# EAGLE design gps-carrier (EAGLE 6.6.0)
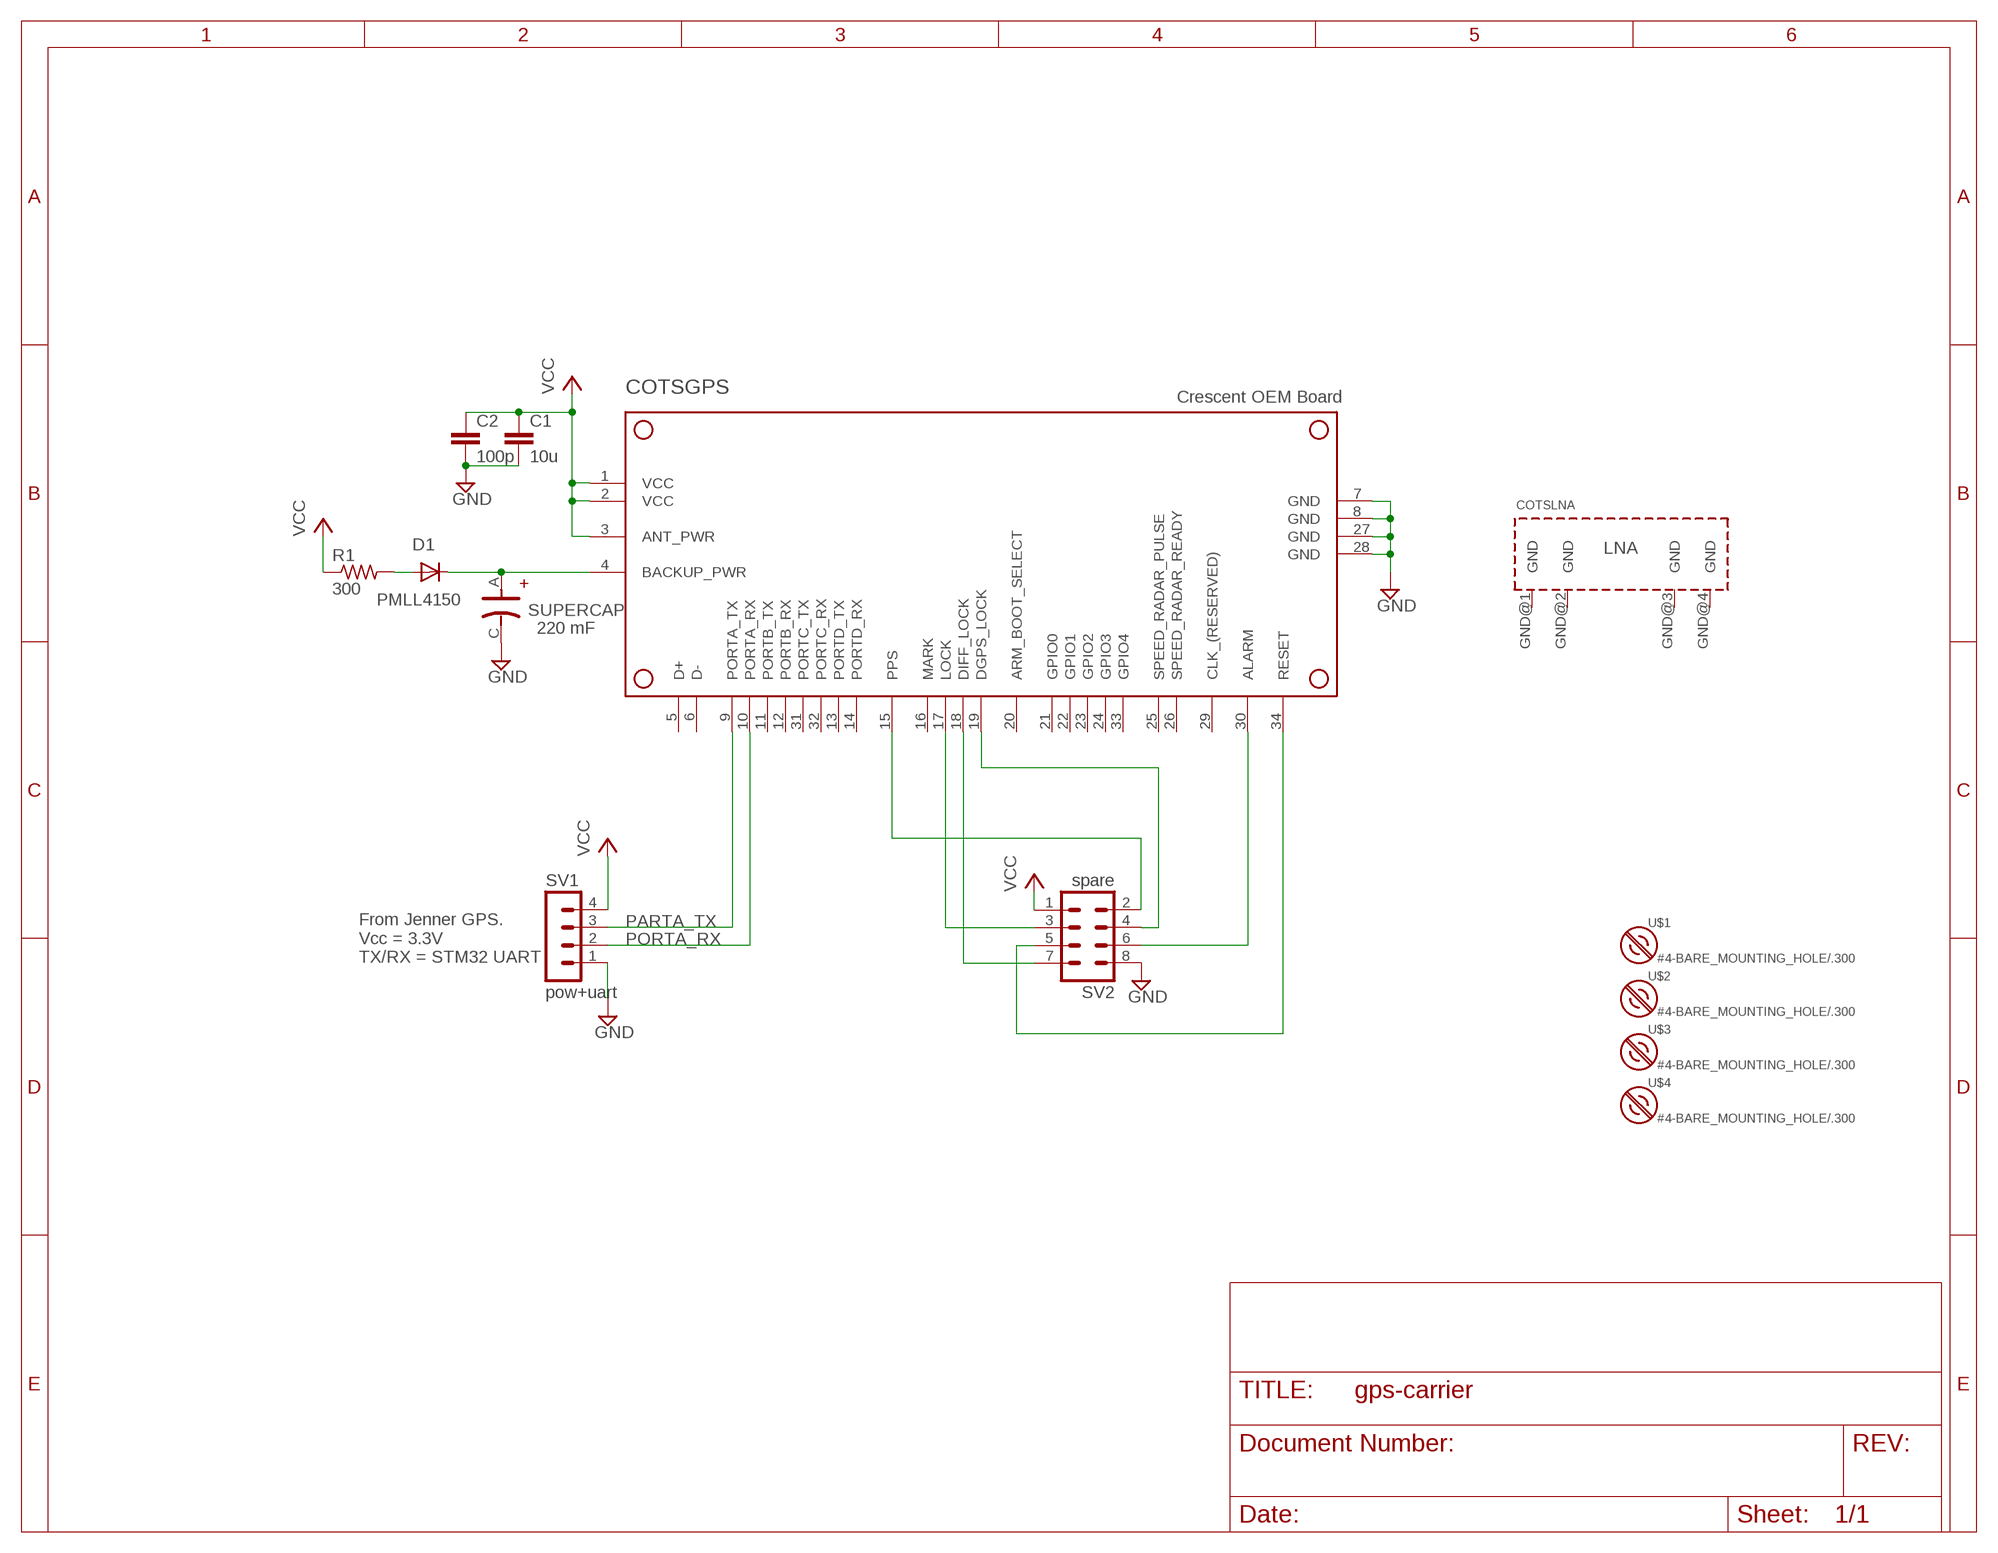
[diagram p0: schematic, sheet 1]

## Parts
C1  10u  C-EUC0805  [C0805]
C2  100p  C-EUC0603  [C0603]
COTSGPS  HEMISPHERE_GPS_MOUNT  [GPS_CRECENT_OUTLINE]
COTSLNA  GPS_LNA  [GPS_LNA]
D1  PMLL4150  [SOD80C]
R1  300  R-US_R0603  [R0603]
SUPERCAP  220 mF  DSK-3R3H224U-HL  [DSK-HL]
SV1  pow+uart  MA04-1  [MA04-1]
SV2  spare  MA04-2  [MA04-2]
U$1  #4-BARE_MOUNTING_HOLE/.300  [#4/.300-BARE+STD_NUT_OR_STAR_WASHER]
U$2  #4-BARE_MOUNTING_HOLE/.300  [#4/.300-BARE+STD_NUT_OR_STAR_WASHER]
U$3  #4-BARE_MOUNTING_HOLE/.300  [#4/.300-BARE+STD_NUT_OR_STAR_WASHER]
U$4  #4-BARE_MOUNTING_HOLE/.300  [#4/.300-BARE+STD_NUT_OR_STAR_WASHER]

## Nets
ALARM: COTSGPS.30(ALARM) SV2.6
BACKUPRAM: COTSGPS.4(BACKUP_PWR) D1.C SUPERCAP.A
DGPS: COTSGPS.19(DGPS_LOCK) SV2.4
DIFF_LOCK: COTSGPS.18(DIFF_LOCK) SV2.7
GND: C1.2 C2.2 COTSGPS.7(GND) COTSGPS.8(GND) COTSGPS.27(GND) COTSGPS.28(GND) SUPERCAP.C SV1.1 SV2.8
LOCK: COTSGPS.17(LOCK) SV2.3
N$1: D1.A R1.2
N$2: COTSGPS.34(RESET) SV2.5
PARTA_TX: COTSGPS.9(PORTA_TX) SV1.3
PORTA_RX: COTSGPS.10(PORTA_RX) SV1.2
PPS: COTSGPS.15(PPS) SV2.2
VCC: C1.1 C2.1 COTSGPS.1(VCC) COTSGPS.2(VCC) COTSGPS.3(ANT_PWR) R1.1 SV1.4 SV2.1
Unconnected: COTSGPS.5(D+) COTSGPS.6(D-) COTSGPS.11(PORTB_TX) COTSGPS.12(PORTB_RX) COTSGPS.13(PORTD_TX) COTSGPS.14(PORTD_RX) COTSGPS.16(MARK) COTSGPS.20(ARM_BOOT_SELECT) COTSGPS.21(GPIO0) COTSGPS.22(GPIO1) COTSGPS.23(GPIO2) COTSGPS.24(GPIO3) COTSGPS.25(SPEED_RADAR_PULSE) COTSGPS.26(SPEED_RADAR_READY) COTSGPS.29(CLK_(RESERVED)) COTSGPS.31(PORTC_TX) COTSGPS.32(PORTC_RX) COTSGPS.33(GPIO4) COTSLNA.GND@1(GND) COTSLNA.GND@2(GND) COTSLNA.GND@3(GND) COTSLNA.GND@4(GND)

## Notes on the sheet
- From Jenner GPS. 
  Vcc = 3.3V
  TX/RX = STM32 UART

## Library data of the parts
C1 C2 = rcl:C-EU: CAPACITOR, European symbol
COTSGPS = GPS_Hemisphere:HEMISPHERE_GPS_MOUNT: Outline for the "Hemisphere GPS" Crescent OEM Board
COTSLNA = GPS_Hemisphere:GPS_LNA: LNA
D1 = diode:PMLL4150: DIODE high speed
R1 = rcl:R-US_: RESISTOR, American symbol
SUPERCAP = gps-carrier:DSK-3R3H224U-HL: Electric Double Layer Sueper Capacitor Low profile coin cell supercap.
SV1 = con-lstb:MA04-1: PIN HEADER; OC_FARNELL: unknown; OC_NEWARK: unknown
SV2 = con-lstb:MA04-2: PIN HEADER; OC_FARNELL: unknown; OC_NEWARK: unknown
U$1-U$4 = mount:#4-BARE_MOUNTING_HOLE: 1/8" drill hole for #4 screw mount

## Board
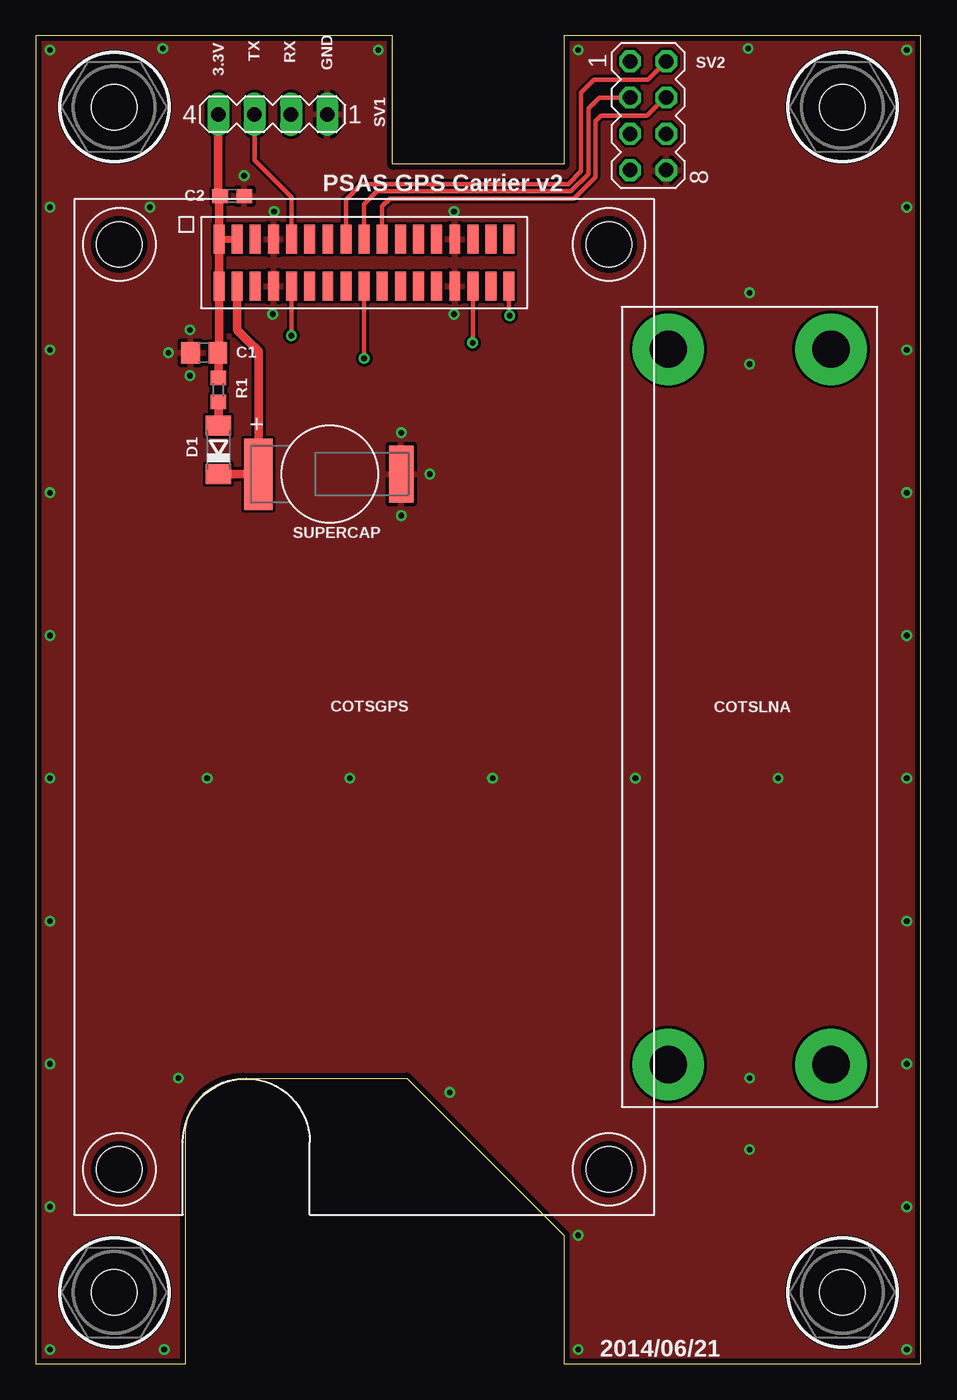
[diagram p1: board, top side]
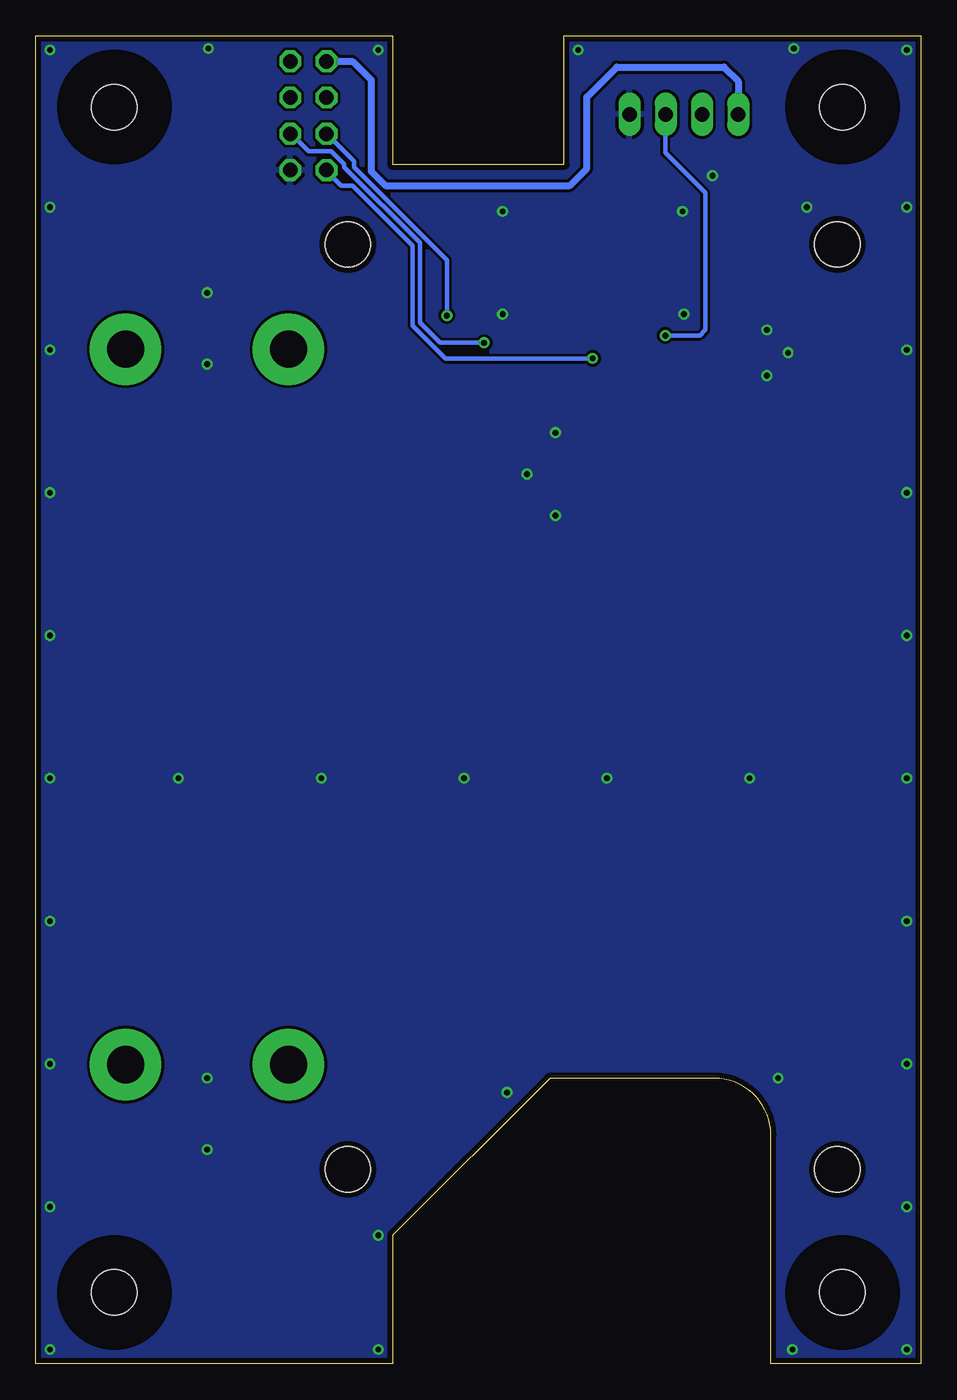
[diagram p2: board, bottom side, seen from below]

Size 62 x 93 mm. Coordinates in mm from the lower left corner, seen from the top.
Outline: 0,0 10.5,0 10.5,16 arc-90 14.5,20 26,20 37,9 37,0 62,0 62,93 37,93 37,84 25,84 25,93 0,93 0,0
Copper layers (1*16): Top 0.0356mm / dielectric 1.5011mm / Bottom 0.0356mm
Design rules "LaenPCBOrder": minimum track width 6mil, minimum drill 13mil, track to track 6mil, track to pad 6mil, pad to pad 6mil, via to via 6mil, smd to smd 6mil, copper to edge 15mil, drill to drill 6mil, minimum pad ring 7mil, minimum via ring 7mil, stop-mask expansion 3mil, vias tented up to drill 0mil, thermal gap 10mil

### Footprints (pad centres in the part's own frame; a part is rotated, then mirrored left to right if it is on the bottom)
C0805 = smd 1.3 x 1.5: 1 -0.95,0; 2 0.95,0
C0603 = smd 1.1 x 1: 1 -0.85,0; 2 0.85,0
GPS_CRECENT_OUTLINE = smd 2.032 x 0.762: 1 -32.766,-10.16; 2 -29.464,-10.16; 3 -32.766,-8.89; 4 -29.464,-8.89; 5 -32.766,-7.62; 6 -29.464,-7.62; 7 -32.766,-6.35; 8 -29.464,-6.35; 9 -32.766,-5.08; 10 -29.464,-5.08; 11 -32.766,-3.81; 12 -29.464,-3.81; 13 -32.766,-2.54; 14 -29.464,-2.54; 15 -32.766,-1.27; 16 -29.464,-1.27; 17 -32.766,0; 18 -29.464,0; 19 -32.766,1.27; 20 -29.464,1.27; 21 -32.766,2.54; 22 -29.464,2.54; 23 -32.766,3.81; 24 -29.464,3.81; 25 -32.766,5.08; 26 -29.464,5.08; 27 -32.766,6.35; 28 -29.464,6.35; 29 -32.766,7.62; 30 -29.464,7.62; 31 -32.766,8.89; 32 -29.464,8.89; 33 -32.766,10.16; 34 -29.464,10.16 | hole 3.175: -32.385,17.145; -32.385,-17.145; 32.385,-17.145; 32.385,17.145
GPS_LNA = drill 2.6 pad 5: GND@1 -25.05,5.7; GND@2 -25.05,-5.7; GND@3 25.05,5.7; GND@4 25.05,-5.7
SOD80C = smd 1.4 x 1.8: A 1.7,0; C -1.7,0
R0603 = smd 1 x 1.1: 1 -0.85,0; 2 0.85,0
DSK-HL = smd 5 x 2: A 0,5 | smd 4 x 1.7: C 0,-5
MA04-1 = drill 1.016 long: 1 -3.81,0; 2 -1.27,0; 3 1.27,0; 4 3.81,0
MA04-2 = drill 1.016 octagon: 1 -3.81,-1.27; 2 -3.81,1.27; 3 -1.27,-1.27; 4 -1.27,1.27; 5 1.27,-1.27; 6 1.27,1.27; 7 3.81,-1.27; 8 3.81,1.27
#4/.300-BARE+STD_NUT_OR_STAR_WASHER = hole 3.175: 0,0

### Placement (x,y rotation side)
C1  11.8,70.8 180 top
C2  13.76,81.77 0 top
COTSGPS  23,46 270 top
COTSLNA  50,46 90 top
D1  12.8,64 90 top
R1  12.8,68.2 270 top
SUPERCAP  20.6,62.3 90 top
SV1  16.6,87.5 180 top
SV2  42.9,87.4 270 top
U$1  56.5,88 0 top
U$2  56.5,5 0 top
U$3  5.5,88 0 top
U$4  5.5,5 0 top

### Tracks (layer width: path | path; a pad name or v marks a point on that pad's centre or on a via)
ALARM  (via drill 0.4)
  Top 0.3: COTSGPS.30 30.62,71.52 v30.6,71.5
  Bottom 0.3: SV2.6 44.13,86.13 42.9,84.9 41.3,84.9 40.4,84 40.4,83.8 35.1,78.5 35.1,72.9 33.7,71.5 v30.6,71.5
BACKUPRAM
  Top 0.6: D1.C SUPERCAP.A 15.6,70.9 14.8,71.7 14.5,72 14.11,72.39 COTSGPS.4
DGPS
  Top 0.3: SV2.4 44.07,88.67 42.8,87.4 39.6,87.4 39.2,87 39.2,83.1 37.7,81.6 24.8,81.6 24.27,81.07 COTSGPS.19
DIFF_LOCK  (via drill 0.4)
  Top 0.3: COTSGPS.18 v23,70.4
  Bottom 0.3: v23,70.4 33.3,70.4 35.6,72.7 35.6,78.3 39.8,82.5 40.6,82.5 41.63,83.53 SV2.7
GND  (via drill 0.4)
  other vias: 10,20 24,92 16.6,73.5 16.7,80.7 9.3,70.8 14.6,83.2 25.6,65.2 27.6,62.3 25.6,59.4 8,81 1,81 1,71 1,61 1,51 1,41 1,31 1,21 1,11 61,81 61,71 61,61 61,51 61,41 61,31 61,21 61,11 29,19 38,9 50,15 50,20 50,70 50,75 12,41 22,41 32,41 42,41 52,41 29.3,73.5 29.3,80.7 49.9,92.1 8.9,92.1 38,92 1,92 61,92 61,1 38,1 9,1 1,1 10.8,69.2 10.8,72.4
  pour Bottom (isolate 0.2): 0,0 0,93 62,93 62,0
  pour Top (isolate 0.2): 0,0 0,93 62,93 62,0
LOCK
  Top 0.3: COTSGPS.17 23,81.2 23.9,82.1 37.5,82.1 38.7,83.3 38.7,87.9 39.47,88.67 SV2.3
N$1
  Top 0.6: R1.2 12.8,65.9 12.9,65.8 D1.A
N$2  (via drill 0.4)
  Top 0.3: COTSGPS.34 33.16,73.64 v33.2,73.4
  Bottom 0.3: v33.2,73.4 33.2,77.3 39.7,83.8 39.7,84.2 SV2.5
PARTA_TX
  Top 0.3: COTSGPS.9 17.92,81.68 15.33,84.27 SV1.3
PORTA_RX  (via drill 0.4)
  Top 0.3: COTSGPS.10 17.92,72.02 v17.9,72
  Bottom 0.3: v17.9,72 15.5,72 15.1,72.4 15.1,82 17.9,84.8 17.9,87.47 SV1.2
PPS
  Top 0.3: SV2.2 42.86,89.9 39.1,89.9 38.2,89 38.2,83.5 37.3,82.6 22.8,82.6 21.73,81.53 COTSGPS.15
VCC
  Top 0.5: 12.84,87.57 SV1.4 | COTSGPS.1 COTSGPS.3
  Top 0.6: SV1.4 12.79,81.89 C2.1 12.84,81.7 COTSGPS.1 COTSGPS.2 12.84,70.89 C1.1 12.8,70.75 R1.1
  Bottom 0.5: SV2.1 39.81,91.21 38.5,89.9 38.5,83.5 37.5,82.5 24.6,82.5 23.4,83.7 23.4,88.7 21.3,90.8 13.8,90.8 12.8,89.8 SV1.4

### Text on the board
tPlace: TX | RX | GND | 3.3V | PSAS GPS Carrier v2 | 2014/06/21